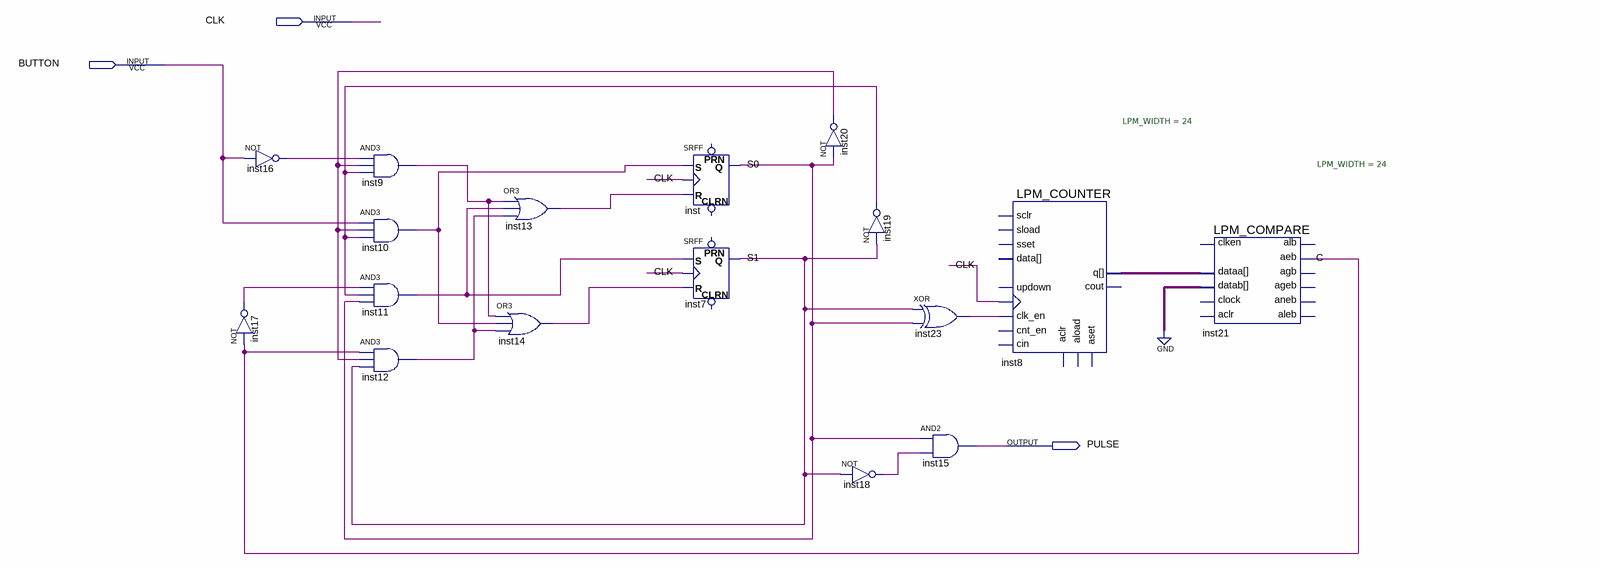
[diagram p0: schematic sheet]
// Quartus schematic g07_debounder.bdf as structural Verilog: 17 symbols, 3 pins
module g07_debounder (
  input  CLK,
  input  BUTTON,
  output PULSE
);

  wire C, inst9_out, inst10_out, inst11_out, inst12_out, inst13_out, inst14_out, inst16_out, inst17_out,
       inst18_out, inst19_out, inst20_out, inst23_out, S0, S1;
  wire [23:0] inst8_q;

  not inst16 (inst16_out, BUTTON);
  not inst17 (inst17_out, C);
  and inst9 (inst9_out, inst16_out, inst20_out, inst19_out);
  and inst10 (inst10_out, BUTTON, inst20_out, inst19_out);
  and inst11 (inst11_out, inst17_out, inst19_out, S0);
  and inst12 (inst12_out, C, inst20_out, S1);
  or inst13 (inst13_out, inst9_out, inst11_out, inst12_out);
  or inst14 (inst14_out, inst9_out, inst10_out, inst12_out);
  SRFF inst (.S(inst10_out), .R(inst13_out), .CLK(CLK), .Q(S0));  // open: PRN, CLRN
  SRFF inst7 (.S(inst11_out), .R(inst14_out), .CLK(CLK), .Q(S1));  // open: PRN, CLRN
  not inst20 (inst20_out, S0);
  not inst19 (inst19_out, S1);
  not inst18 (inst18_out, S1);
  xor inst23 (inst23_out, S1, S0);
  and inst15 (PULSE, S0, inst18_out);
  LPM_COUNTER #(.LPM_WIDTH(24)) inst8 (
    .clock(CLK), .clk_en(inst23_out), .q(inst8_q));  // open: sload, data, aload, aclr, aset, cin, sset, updown, cnt_en, sclr, cout
  LPM_COMPARE #(.LPM_WIDTH(24)) inst21 (
    .dataa(inst8_q), .datab({24{1'b0}}), .aeb(C));  // open: clock, aclr, clken, aleb, agb, aneb, ageb, alb
endmodule
